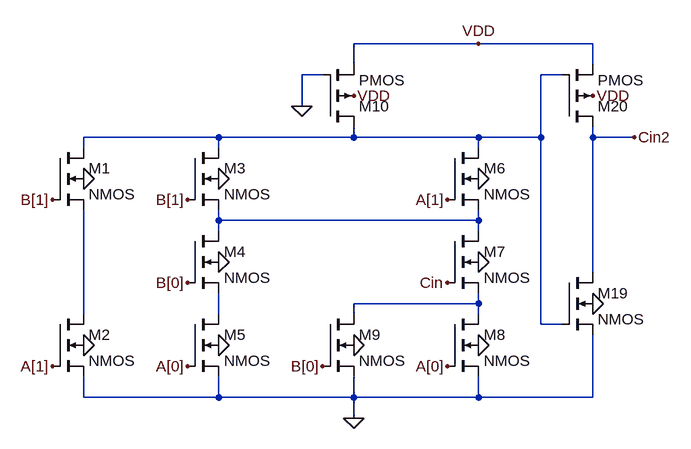
[diagram p0: schematic Carry_in2_pseudo.asc]
Carry_in2_pseudo.asc, the LTspice schematic file:
Version 4
SHEET 1 996 680
WIRE 688 32 496 32
WIRE 864 32 688 32
WIRE 496 64 496 32
WIRE 864 64 864 32
WIRE 448 80 416 80
WIRE 816 80 784 80
WIRE 416 128 416 80
WIRE 288 176 80 176
WIRE 496 176 496 160
WIRE 496 176 288 176
WIRE 688 176 496 176
WIRE 784 176 784 80
WIRE 784 176 688 176
WIRE 864 176 864 160
WIRE 928 176 864 176
WIRE 80 192 80 176
WIRE 288 192 288 176
WIRE 688 192 688 176
WIRE 288 304 288 288
WIRE 688 304 688 288
WIRE 688 304 288 304
WIRE 288 320 288 304
WIRE 688 320 688 304
WIRE 864 384 864 176
WIRE 688 432 688 416
WIRE 688 432 496 432
WIRE 80 448 80 288
WIRE 288 448 288 416
WIRE 496 448 496 432
WIRE 688 448 688 432
WIRE 784 464 784 176
WIRE 816 464 784 464
WIRE 80 576 80 544
WIRE 288 576 288 544
WIRE 288 576 80 576
WIRE 496 576 496 544
WIRE 496 576 288 576
WIRE 688 576 688 544
WIRE 688 576 496 576
WIRE 864 576 864 480
WIRE 864 576 688 576
WIRE 496 608 496 576
FLAG 32 528 A[1]
FLAG 640 272 A[1]
FLAG 640 528 A[0]
FLAG 240 528 A[0]
FLAG 448 528 B[0]
FLAG 240 400 B[0]
FLAG 240 272 B[1]
FLAG 32 272 B[1]
FLAG 640 400 Cin
FLAG 864 432 0
FLAG 688 240 0
FLAG 688 368 0
FLAG 688 496 0
FLAG 496 496 0
FLAG 288 240 0
FLAG 288 368 0
FLAG 288 496 0
FLAG 80 496 0
FLAG 80 240 0
FLAG 864 112 VDD
FLAG 496 608 0
FLAG 928 176 Cin2
FLAG 416 128 0
FLAG 496 112 VDD
FLAG 688 32 VDD
SYMBOL nmos4 32 192 R0
SYMATTR InstName M1
SYMBOL nmos4 32 448 R0
SYMATTR InstName M2
SYMBOL nmos4 240 192 R0
SYMATTR InstName M3
SYMBOL nmos4 240 320 R0
SYMATTR InstName M4
SYMBOL nmos4 240 448 R0
SYMATTR InstName M5
SYMBOL nmos4 640 192 R0
SYMATTR InstName M6
SYMBOL nmos4 640 320 R0
SYMATTR InstName M7
SYMBOL nmos4 640 448 R0
SYMATTR InstName M8
SYMBOL nmos4 448 448 R0
SYMATTR InstName M9
SYMBOL nmos4 816 384 R0
SYMATTR InstName M19
SYMBOL pmos4 816 160 M180
SYMATTR InstName M20
SYMBOL pmos4 448 160 M180
SYMATTR InstName M10

The netlist it stands for:
* Carry_in2_pseudo.asc
M1 N001 B[1] N004 0 NMOS
M2 N004 A[1] 0 0 NMOS
M3 N001 B[1] N002 0 NMOS
M4 N002 B[0] N005 0 NMOS
M5 N005 A[0] 0 0 NMOS
M6 N001 A[1] N002 0 NMOS
M7 N002 Cin N003 0 NMOS
M8 N003 A[0] 0 0 NMOS
M9 N003 B[0] 0 0 NMOS
M19 Cin2 N001 0 0 NMOS
M20 Cin2 N001 VDD VDD PMOS
M10 N001 0 VDD VDD PMOS
.model NMOS NMOS
.model PMOS PMOS
.lib standard.mos
.backanno
.end